# Altium schematic sheet Power supplies.SchDoc
size A4; Author: Thomas Kreppel; CompanyName: Universidad de Santiago de Chile; Address1: Avenida Ecuador Nº 3519; Address2: Estación Central, Santiago; Address3: Chile; DocumentNumber: 3; SheetNumber: 3; SheetTotal: 10
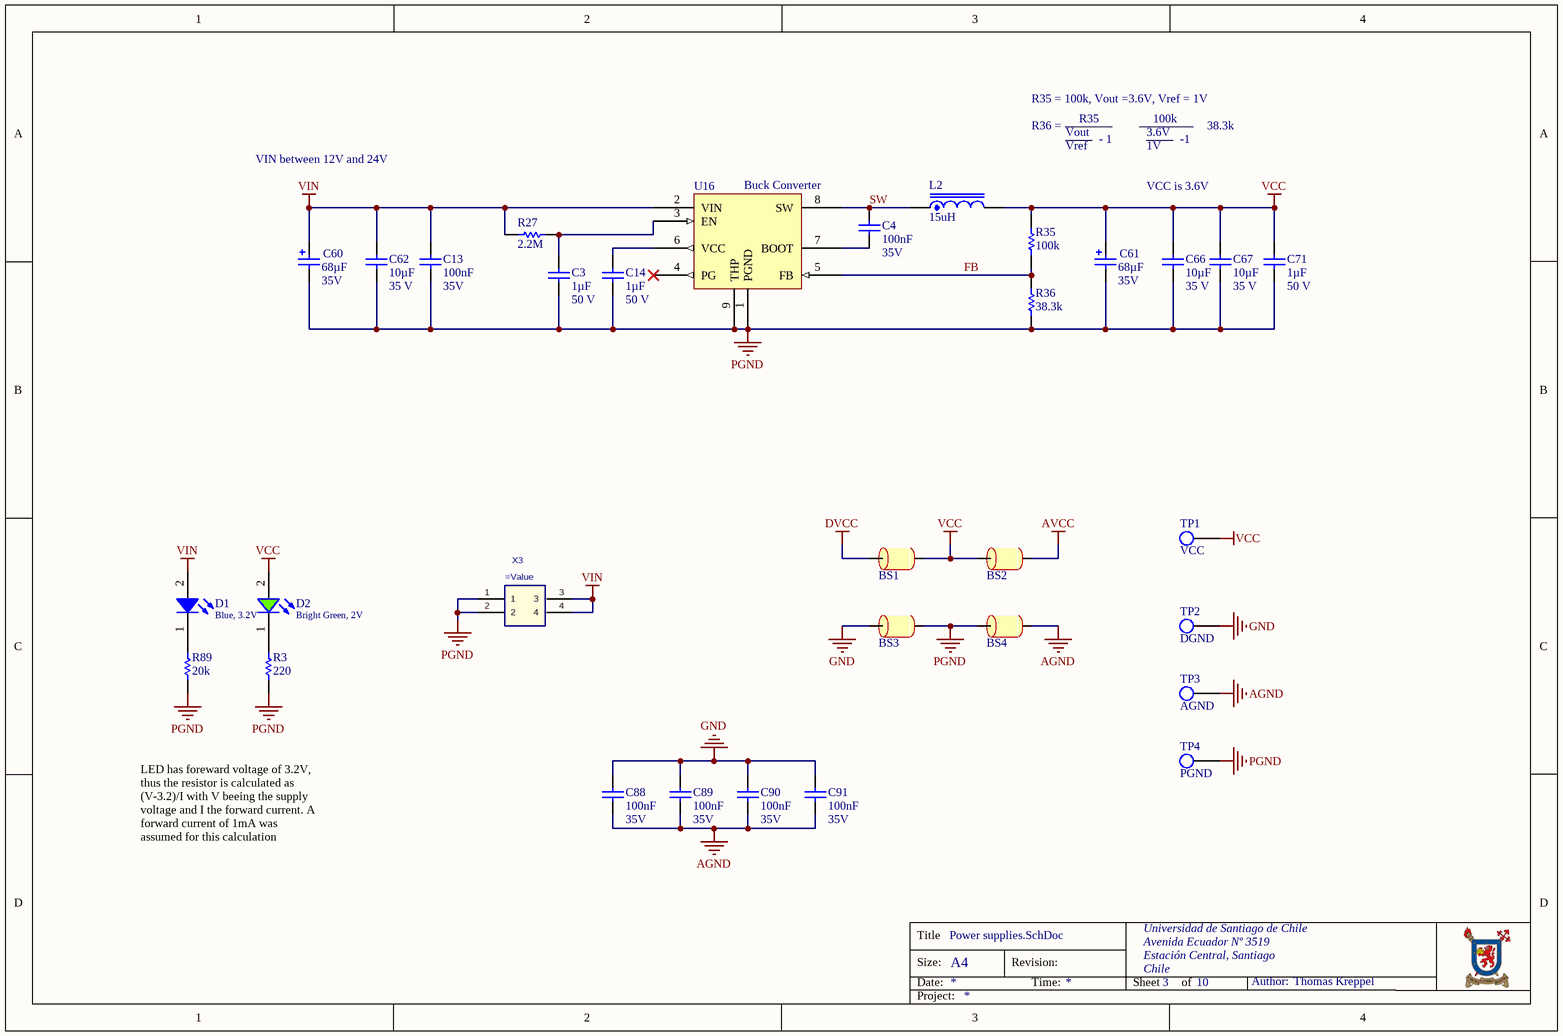
[diagram p0: Power supplies.SchDoc]

## Parts
BS1  Ferrite bead  [RES_1206]  (value not drawn)
BS2  Ferrite bead  [RES_1206]  (value not drawn)
BS3  Ferrite bead  [RES_1206]  (value not drawn)
BS4  Ferrite bead  [RES_1206]  (value not drawn)
C3  1µF  Voltage: 50 V  [CAP_0603]
C4  100nF  Voltage: 35V  [CAP_0603]
C13  100nF  Voltage: 35V  [CAP_0603]
C14  1µF  Voltage: 50 V  [CAP_0603]
C60  68µF  Voltage: 35V  [WCAP-ATG8_6.3x11]
C61  68µF  Voltage: 35V  [WCAP-ATG8_6.3x11]
C62  10µF  Voltage: 35 V  [RES_1206]
C66  10µF  Voltage: 35 V  [RES_1206]
C67  10µF  Voltage: 35 V  [RES_1206]
C71  1µF  Voltage: 50 V  [CAP_0603]
C88  100nF  Voltage: 35V  [CAP_0603]
C89  100nF  Voltage: 35V  [CAP_0603]
C90  100nF  Voltage: 35V  [CAP_0603]
C91  100nF  Voltage: 35V  [CAP_0603]
D1  Blue, 3.2V  [WL-SMCW_0603_H=0.7mm]
D2  Bright Green, 2V  [WL-SMCW_0603_H=0.7mm]
L2  15uH  [SMT_inductor_1050_Performance]
R3  220  [RES_0603]
R27  2.2M  [RES_0603]
R35  100k  [RES_0603]
R36  38.3k  [RES_0603]
R89  20k  [RES_0603]
TP1  VCC  [TP_1.6mm]  (no BOM)
TP2  DGND  [TP_1.6mm]  (no BOM)
TP3  AGND  [TP_1.6mm]  (no BOM)
TP4  PGND  [TP_1.6mm]  (no BOM)
U16  Buck Converter  [SOIC127P600X170_HS-9N]
X3  (no value)  [IPL1-102-01-L-D-K]

## Nets
AGND: BS4.2 C88.2 C89.2 C90.2 C91.2 TP3.1
AVCC: BS2.2
DVCC: BS1.1
GND: BS3.1 C88.1 C89.1 C90.1 C91.1 TP2.1
PGND: BS3.2 BS4.1 C3.2 C13.2 C14.2 C60.1(N) C61.1(N) C62.2 C66.2 C67.2 C71.2 R3.1 R36.1 R89.2 TP4.1 U16.1(PGND) U16.9(THP) X3.1 X3.2
VCC: BS1.2 BS2.1 C61.2(P) C66.1 C67.1 C71.1 D2.2(A) L2.2 R35.2 TP1.1
VIN: C13.1 C60.2(P) C62.1 D1.2(A) R27.2 U16.2(VIN) X3.3 X3.4
FB: R35.1 R36.2 U16.5(FB)
SW: C4.1 L2.1 U16.8(SW)
NetC3_1: C3.1 R27.1 U16.3(EN)
NetC4_2: C4.2 U16.7(BOOT)
NetC14_1: C14.1 U16.6(VCC)
NetD1_1: D1.1(K) R89.1
NetD2_1: D2.1(K) R3.2

Not connected (* = marked no-connect by the designer): U16 4(PG)*

## Notes on the sheet
- R35 = 100k, Vout =3.6V, Vref = 1V
- VIN between 12V and 24V
- R36 =
- Vout
- Vref
- R35
- - 1
- 3.6V
- 1V
- 100k
- -1
- 38.3k
- VCC is 3.6V
- LED has foreward voltage of 3.2V, thus the resistor is calculated as (V-3.2)/I with V beeing the supply voltage and I the forward current. A forward current of 1mA was assumed for this calculation
- Title
- Size:
- Date:
- A4
- Revision:
- Time:
- Sheet
- of
- Author:
- Project:

## Library data of the parts
BS1-BS4 = Bead: 6A; MPN: 742792121; MF: Würth Elektronik; DCR: 60mOhm; I_r: 3A; Supplier 1: Digikey; Supplier Part Number 1: 732-4654-1-ND; Package: 1206
C3 C14 C71 = Cap_0603: Capacitor Ceramic; MPN: C0603C105K3RACTU; MF: KEMET; Dielectricum: X7R; Tolerance: 10%; Value: 1µF; Supplier 1: Digikey; Supplier Part Number 1: 399-7376-1-ND; Package: 0603
C4 C13 C88-C91 = Cap_0603: Capacitor; MPN: C0603C104M5RACTU; Rule: PcbType=ProtelPcb; MF: KEMET; Dielectricum: X7R; Tolerance: 10%; Published: 8-Jun-2000; LatestRevisionDate: 17-Jul-2002; LatestRevisionNote: Re-released for DXP Platform.; PackageReference: RAD-0.3; Publisher: Altium Limited; Value: 100nF; Supplier 1: Digikey; Supplier 2: Mouser; Supplier Part Number 1: 399-7845-1-ND; Package: 0603
C60 C61 = 860010573006: WCAP-ATG8 THT Aluminum Electrolytic Capacitors, D6.3mm x L11mm, 68uF, +/-20%, 35VDC; Dissipation Factor: 12%; Endurance: 2000h; Leakage Current: 23.8uA; Ripple Current max.: 198mA; Technical Reference: ATBD110680M035DSPA4B000; ComponentLink1Description: Manufacturer; ComponentLink1URL: http://www.we-online.de; ComponentLink2Description: Datasheet; ComponentLink2URL: https://katalog.we-online.com/pbs/datasheet/860010573006.pdf; Length: 11mm; Mounting Technology: THT; Operating Temperature: -40 to +85degC; Packaging: Ammo Pack; Published Date: August 2019; Value: 68µF; Diameter: 6.3mm; Part Number: 860010573006; Publisher: Wurth Elektronik; Tolerance: +/-20%; Supplier 1: Digikey; Supplier Part Number 1: 732-8736-1-ND
C62 C66 C67 = Cap_1206: Capacitor; MPN: GRM319R6YA106KA12D; Dielectricum: X7R; Tolerance: 10%; Value: 10µF; Supplier 1: Digikey; Supplier Part Number 1: 490-9964-1-ND; MF: *; Package: 1206
D1 = 150060BS75000: WL-SMCW SMT Mono-color Chip LED Waterclear, size 0603, Blue, 3.2V, 140deg; Chip Technology: InGaN; Dominant Wavelength typ.: 470nm; Luminous Intensity typ.: 145mcd; Peak Wavelength typ.: 465nm; MF: Wurth Elektronik; Viewing Angle: 140deg; ComponentLink1Description: Manufacturer; ComponentLink1URL: http://www.we-online.de; ComponentLink2URL: https://www.we-online.com/catalog/datasheet/150060BS75000.pdf; ComponentLink2Description: Datasheet; Forward Voltage typ.: 3.2V; Emitting Color: Blue; Mounting Technology: SMT; Operating Temperature: -40 to +85degC; Published Date: December 2019; MPN: 150060BS75000; Packaging: Tape and Reel; Package: 0603; Supplier 1: Digikey; Supplier Part Number 1: 732-4966-1-ND
D2 = 150060VS75000: WL-SMCW SMT Mono-color Chip LED Waterclear, size 0603, Bright Green, 2V, 140deg; Chip Technology: AlInGaP; Dominant Wavelength typ.: 570nm; Luminous Intensity typ.: 40mcd; Peak Wavelength typ.: 572nm; MF: Wurth Elektronik; Viewing Angle: 140deg; ComponentLink1Description: Manufacturer; ComponentLink1URL: http://www.we-online.de; ComponentLink2URL: https://www.we-online.com/catalog/datasheet/150060VS75000.pdf; ComponentLink2Description: Datasheet; Forward Voltage typ.: 2V; Emitting Color: Bright Green; Mounting Technology: SMT; Operating Temperature: -40 to +85degC; Published Date: December 2019; MPN: 150060VS75000; Packaging: Tape and Reel; Package: 0603; Supplier 1: Digikey; Supplier Part Number 1: 732-4980-1-ND
L2 = B82464G4154M: SMT power Inductor, 15uH, 40m DRC; Manufacturer: Murata; Rated Current: 3.7 A; Supplier 1: Digikey; Supplier Part Number 1: 811-3837-1-ND; Value: 15uH; DCR: 40m; Supplier 2: Mouser
R3 = Res0603: Manufacturer Part-Number: RC0603JR-07220RL; Tolerance: 1%; Published: 8-Jun-2000; LatestRevisionDate: 17-Jul-2002; LatestRevisionNote: Re-released for DXP Platform.; PackageReference: AXIAL-0.3; Publisher: Altium Limited; PackageDescription: Axial Device, Thru-Hole; 2 Leads; 0.3 in Pin Spacing; Value: 220; Supplier 1: Digikey; Supplier 2: Mouser; Supplier Part Number 1: 311-220GRCT-ND; Package: 0603
R27 = Res0603: MPN: RC0603FR-072M2L; MF: Yageo; Tolerance: 1%; Published: 8-Jun-2000; LatestRevisionDate: 17-Jul-2002; LatestRevisionNote: Re-released for DXP Platform.; PackageReference: AXIAL-0.3; Publisher: Altium Limited; PackageDescription: Axial Device, Thru-Hole; 2 Leads; 0.3 in Pin Spacing; Value: 2.2M; Supplier 1: Digikey; Supplier Part Number 1: YAG3329CT-ND; Package: 0603
R35 = Res0603: MPN: RC0603FR-07100KL; MF: Yageo; Tolerance: 1%; Published: 8-Jun-2000; LatestRevisionDate: 17-Jul-2002; LatestRevisionNote: Re-released for DXP Platform.; PackageReference: AXIAL-0.3; Publisher: Altium Limited; PackageDescription: Axial Device, Thru-Hole; 2 Leads; 0.3 in Pin Spacing; Value: 100k; Supplier 1: Digikey; Supplier Part Number 1: 311-100KHRCT-ND; Package: 0603
R36 = Res0603: Tolerance: 1%; Published: 8-Jun-2000; LatestRevisionDate: 17-Jul-2002; LatestRevisionNote: Re-released for DXP Platform.; PackageReference: AXIAL-0.3; Publisher: Altium Limited; PackageDescription: Axial Device, Thru-Hole; 2 Leads; 0.3 in Pin Spacing; Value: 38.3k; Supplier 1: Digikey; Supplier 2: Mouser; Supplier Part Number 1: 311-38.3KHRCT-ND; Package: 0603
R89 = Res0603: Manufacturer Part-Number: RC0603FR-07330RL; Tolerance: 1%; Published: 8-Jun-2000; LatestRevisionDate: 17-Jul-2002; LatestRevisionNote: Re-released for DXP Platform.; PackageReference: AXIAL-0.3; Publisher: Altium Limited; PackageDescription: Axial Device, Thru-Hole; 2 Leads; 0.3 in Pin Spacing; Value: 20k; Supplier 1: Digikey; Supplier 2: Mouser; Supplier Part Number 1: 311-330HRCT-ND; Package: 0603
TP1-TP4 = TP: 1.6mm Test Point Keystone; Manufacturer: Keystone Electronics; MPN: 5006; Created: 2020_04_Kreppel; Supplier 1: Digikey; Supplier Part Number 1: 36-5006-ND; Supplier 2: Mouser; MF: Keystone
U16 = LMR33620A: 3.8V to 36V, 2A synchronous step-down converter; Manufacturer: Texas Instruments; Manufacturer Part-Number: LMR33620ADDA; Switching frequency: 400kHz; Created: 4/20 Kreppel; Supplier 1: Digikey; Supplier Part Number 1: 296-48841-ND; Supplier 2: Mouser
X3 = IPL1-102-XX-X-D-X: 2.54mm Double Row Terminal Assembly, Right-Angled; Manufacturer: SAMTEC; Created: 2018_05_02_AGeiger; Value: =MPN; Supplier 2: Mouser; Supplier Part Number 1: SAM10565-ND; Supplier 1: Digikey